# EAGLE design Lightbox (EAGLE 9.2.2)
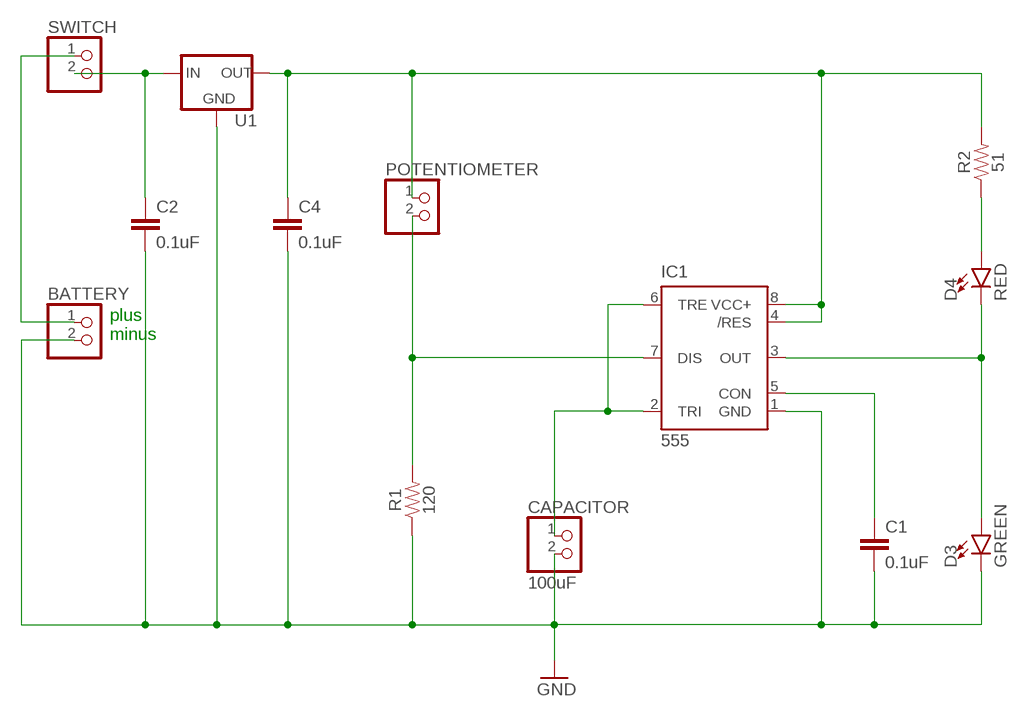
[diagram p0: schematic, sheet 1]

## Parts
BATTERY  PINHD-1X2  [1X02]
C1  0.1uF  0.1UF-0402-16V-10%  [0402]
C2  0.1uF  0.1UF-0402-16V-10%  [0402]
C4  0.1uF  0.1UF-0402-16V-10%  [0402]
CAPACITOR  100uF  PINHD-1X2  [1X02]
D3  GREEN  LED-GREEN1206  [LED-1206]
D4  RED  LED-RED1206  [LED-1206]
IC1  555  555P  [DIP08]
POTENTIOMETER  PINHD-1X2  [1X02]
R1  120  100OHM-0603-1/4W-5%  [0603]
R2  51  220OHM-0603-1/10W-1%  [0603]
SWITCH  PINHD-1X2  [1X02]
U1  V_REG_78XX-TO-220  [TO-220-ALT]

## Nets
GND: BATTERY.2 C1.2 C2.2 C4.2 CAPACITOR.2 D3.C IC1.1(GND) R1.1 U1.GND
N$1: C2.1 SWITCH.2 U1.IN
N$3: D4.A R2.1
N$4: C1.1 IC1.5(CON)
N$5: CAPACITOR.1 IC1.2(TRI) IC1.6(TRE)
N$6: IC1.7(DIS) POTENTIOMETER.2 R1.2
N$9: C4.1 IC1.4(/RES) IC1.8(VCC+) POTENTIOMETER.1 R2.2 U1.OUT
N$10: BATTERY.1 SWITCH.1
N$11: D3.A D4.C IC1.3(OUT)

## Notes on the sheet
- plus
  minus

## Library data of the parts
BATTERY CAPACITOR POTENTIOMETER SWITCH = pinhead:PINHD-1X2: PIN HEADER
C1 C2 C4 = SparkFun-Capacitors:0.1UF: 0.1µF ceramic capacitors A capacitor is a passive two-terminal electrical component used to store electrical energy temporarily in an electric field.; PROD_ID: CAP-12416
D3 = SparkFun-LED:LED-GREEN: Green SMD LED Used in manufacturing of various products at SparkFun Packages: 0603 - SMD 0603 package [Product Link] <http://www.futureelectronics.com/en/technologies/semiconductors/optoelectronics/leds/Pages/9894312-LTST-C190GKT.aspx?CrossPart=HSMG-C190&IM=0> LilyPad 1206 - SMD1206 LilyPad package [Product Link] <http://www.futureelectronics.com/en/Technologies/Product.aspx?ProductID=IN150NGHARVATEKCORPORATION2049943&IM=0> 1206 - SMD1206 package [Product Link] <http://www.futureelectronics.com/en/technologies/semiconductors/optoelectronics/leds/Pages/8315665-LTST-C150KGKT.aspx?IM=0> 1206 Bottom Mount -SMD 1206 Bottom Mount [Product Link] <http://www.digikey.com/product-detail/en/lite-on-inc/LTST-C230KGKT/160-1456-1-ND/386854> SparkFun Products: Pro Mini 328 -5V <https://www.sparkfun.com/products/821> RedBoard <https://www.sparkfun.com/products/12757> MP3 Trigger <https://www.sparkfun.com/products/13720> Makey Makey <https://www.sparkfun.com/products/11076>; PROD_ID: DIO-00862
D4 = SparkFun-LED:LED-RED: Red SMD LED Used in manufacturing of most products at SparkFun Packages: 0603 - SMD 0603 package [Product Link] <http://docs.avagotech.com/docs/AV02-0551EN> 0603 SMART - SMD 0603 SMART package ( more efficient and expensive)[Product Link] <http://www.osram-os.com/Graphics/XPic2/00077099_0.pdf> 1206 - SMD1206 package [Product Link] <https://www.sparkfun.com/datasheets/DevTools/LilyPad/Q150OVS4.pdff> SparkFun Products: Pro Mini 328 -5V <https://www.sparkfun.com/products/821> RedBoard <https://www.sparkfun.com/products/12757> IOIO-OTG <https://www.sparkfun.com/products/13613>; PROD_ID: DIO-09912
IC1 = SparkFun-IC-Special-Function:555: General purpose bipolar Timer Datasheet <http://www.sparkfun.com/datasheets/Components/General/ne555.pdf> SparkFun Products SparkFun SparkPunk Sequencer Kit <https://www.sparkfun.com/products/12707> (KIT-12707) Storefront Component: 555 Timer <https://www.sparkfun.com/products/9273> (COM-09273) Two parts valid for production: VFP: IC-11930 (M7555 PTH) VFP: IC-09173 (555 PTH) - Preferred; PROD_ID: IC-09173; PROD_ID_ALT: IC-09173
R1 = SparkFun-Resistors:100OHM: 100Ω resistor A resistor is a passive two-terminal electrical component that implements electrical resistance as a circuit element. Resistors act to reduce current flow, and, at the same time, act to lower voltage levels within circuits. - Wikipedia; PROD_ID: RES-12438; VALUE: 100
R2 = SparkFun-Resistors:220OHM: 220Ω resistor A resistor is a passive two-terminal electrical component that implements electrical resistance as a circuit element. Resistors act to reduce current flow, and, at the same time, act to lower voltage levels within circuits. - Wikipedia; PROD_ID: RES-07861; VALUE: 220
U1 = SparkFun-IC-Power:V_REG_78XX: Voltage Regulator Standard 78xx regulator. IGO (Input Ground Output). Spark Fun Electronics SKU : COM-00107; PROD_ID: VREG-08450; SF_ID: COM-00107

## Board
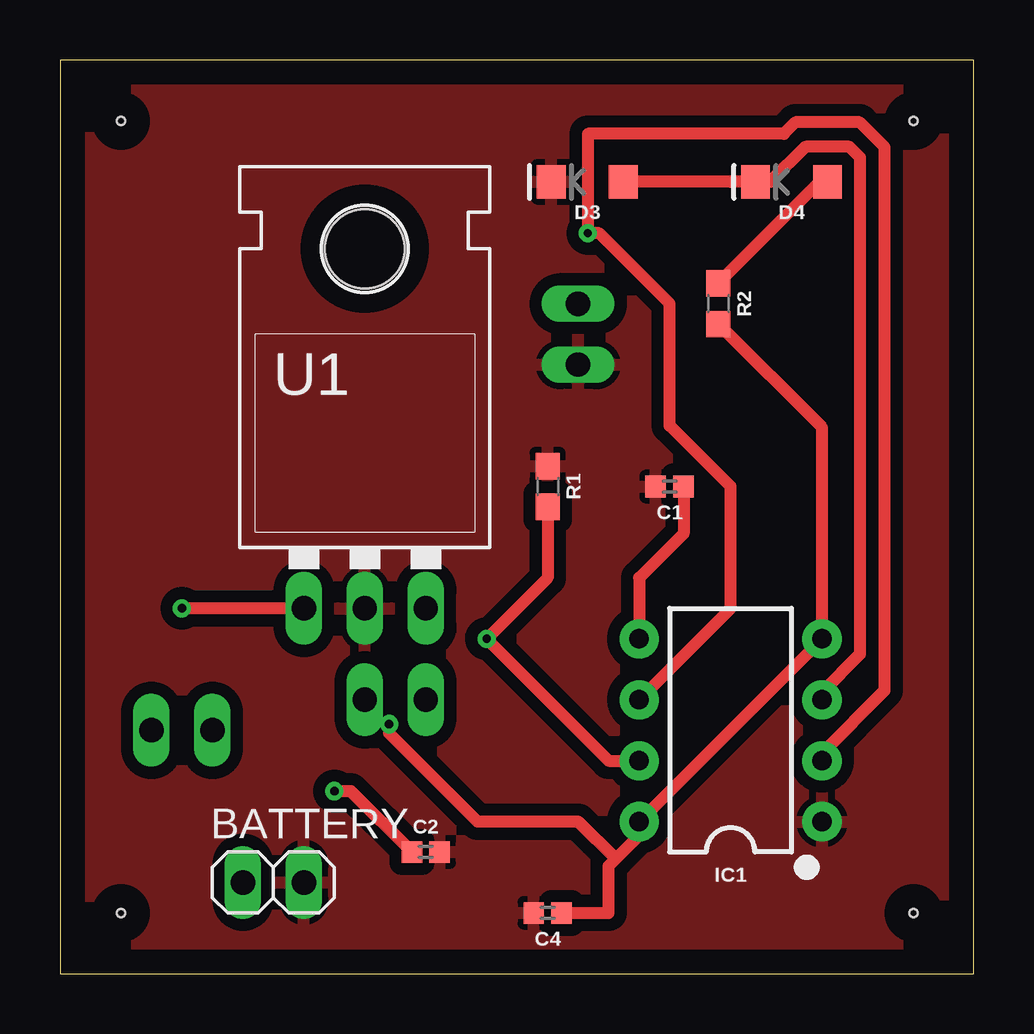
[diagram p1: board, top side]
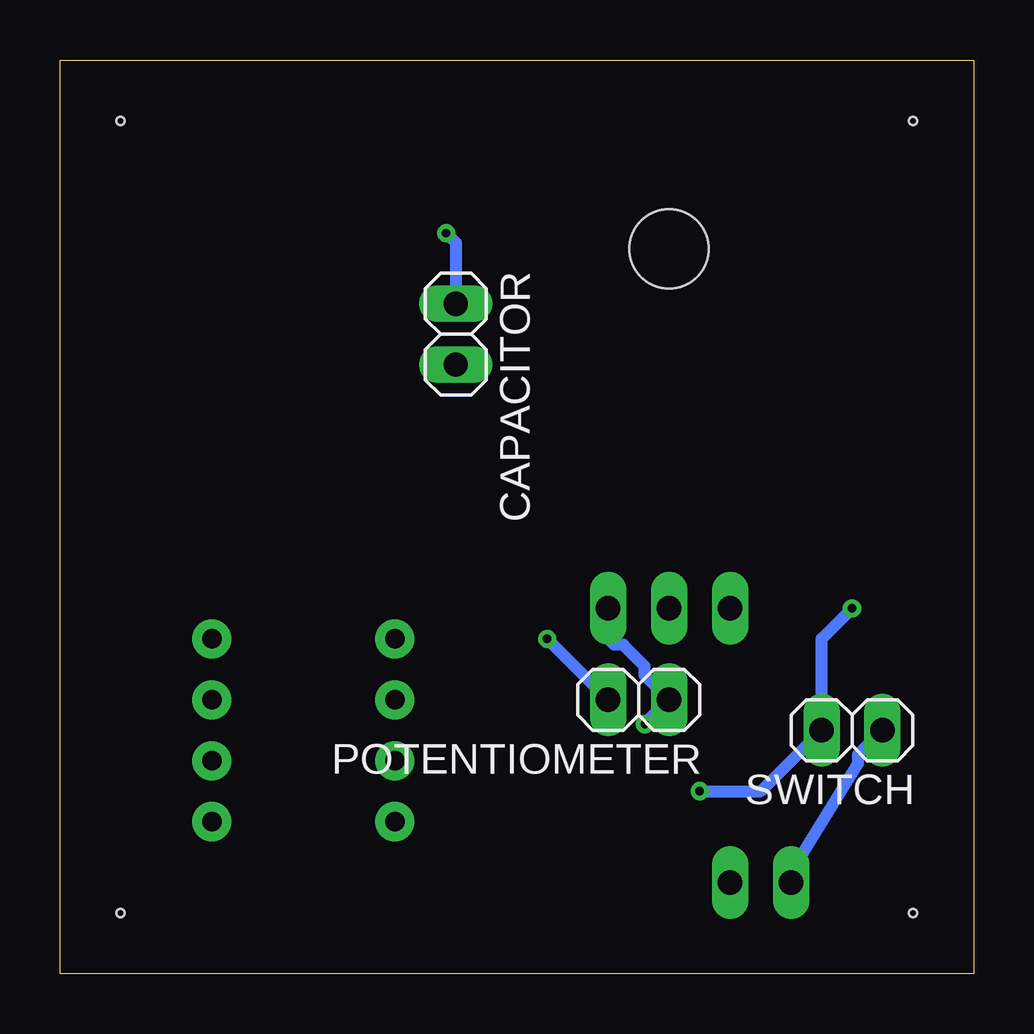
[diagram p2: board, bottom side, seen from below]

Size 38.08 x 38.1 mm. Coordinates in mm from the lower left corner, seen from the top.
Outline: 0,0 38.08,0 38.08,38.1 0,38.1 0,0
Copper layers (1*16): Top 0.035mm / dielectric 1.5mm / Bottom 0.035mm
Design rules "BME_in_house": minimum track width 20mil, minimum drill 0.35mm, track to track 20mil, track to pad 20mil, pad to pad 10mil, via to via 40mil, smd to smd 6mil, copper to edge 40mil, drill to drill 20mil, minimum pad ring 10mil, minimum via ring 8mil, stop-mask expansion 4mil, vias tented up to drill 0mil, thermal gap 10mil
Holes 0.35 mm at 2.54,2.54 35.56,2.54 35.56,35.56 2.54,35.56

### Footprints (pad centres in the part's own frame; a part is rotated, then mirrored left to right if it is on the bottom)
1X02 = drill 1.016 long: 1 -1.27,0; 2 1.27,0
0402 = smd 0.85 x 0.9: 1 -0.58,0; 2 0.58,0
LED-1206 = smd 1.2 x 1.4: A -1.5,0; C 1.5,0
DIP08 = drill 0.813 pad 1.626: 1 -3.81,-3.81; 2 -1.27,-3.81; 3 1.27,-3.81; 4 3.81,-3.81; 5 3.81,3.81; 6 1.27,3.81; 7 -1.27,3.81; 8 -3.81,3.81
0603 = smd 1.1 x 1: 1 -0.85,0; 2 0.85,0
TO-220-ALT = drill 1.016 long: GND 0,-3.81; IN -2.54,-3.81; OUT 2.54,-3.81 | hole 3.302: 0,11.176

### Placement (x,y rotation side)
BATTERY  8.89,3.81 0 top
C1  25.4,20.32 180 top
C2  15.24,5.08 0 top
C4  20.32,2.54 180 top
CAPACITOR  21.59,26.67 270 bottom
D3  21.97,33.02 180 top
D4  30.48,33.02 180 top
IC1  27.94,10.16 90 top
POTENTIOMETER  13.97,11.43 180 bottom
R1  20.32,20.32 270 top
R2  27.43,27.94 270 top
SWITCH  5.08,10.16 180 bottom
U1  12.7,19.05 0 top

### Tracks (layer width: path | path; a pad name or v marks a point on that pad's centre or on a via)
GND
  pour Top: -2.54,40.64 40.64,40.64 40.64,-2.54 -2.54,-2.54
N$1  (via drill 0.35)
  Top 0.508: C2.1 12.12,7.62 v11.43,7.62 | U1.IN v5.08,15.24
  Bottom 0.508: v11.43,7.62 8.89,7.62 SWITCH.2 6.35,13.97 v5.08,15.24
N$3
  Top 0.508: R2.1 31.66,33.02 D4.A
N$4
  Top 0.508: C1.1 25.98,18.36 24.13,16.51 IC1.5
N$5  (via drill 0.35)
  Top 0.508: IC1.6 27.94,15.24 27.94,20.32 25.4,22.86 25.4,27.94 22.46,30.88 v21.99,30.88 21.99,35.02 30.16,35.02 30.64,35.5 33.32,35.5 34.36,34.46 34.36,11.81 31.75,9.2 IC1.2
  Bottom 0.508: v21.99,30.88 21.59,30.48 CAPACITOR.1
N$6  (via drill 0.35)
  Top 0.508: R1.2 20.32,16.51 v17.78,13.97 22.86,8.89 IC1.7
  Bottom 0.508: POTENTIOMETER.2 v17.78,13.97
N$9  (via drill 0.35)
  Top 0.508: v13.72,10.41 13.72,10.04 17.4,6.35 21.59,6.35 23.15,4.79 | 23.15,4.79 24.13,5.77 IC1.8 IC1.4 31.75,22.77 R2.2 | C4.1 22.86,2.54 22.86,4.5 23.15,4.79
  Bottom 0.508: v13.72,10.41 POTENTIOMETER.1 13.72,12.45 13.72,12.82 14.61,13.72 14.99,13.72 15.24,13.97 U1.OUT
N$10
  Bottom 0.508: SWITCH.1 4.83,9.14 4.83,8.77 7.62,4.23 BATTERY.1
N$11
  Top 0.508: D3.A 27.94,33.02 D4.C 29.6,33.02 31.06,34.48 32.9,34.48 33.34,34.04 33.34,13.34 31.75,11.74 IC1.3